# Altium schematic sheet SH4 - 3.3V LINEAR REGULATOR.SchDoc: 3.3V Linear Regulator
size B; CheckedBy: Cindy Li; Engineer: Farris Matar; Organization: UW Robotics; Address1: 200 University Avenue; Address2: Waterloo; Address3: Ontario; Address4: Canada N2L 3G6; DocumentNumber: 4; Revision: 3; SheetNumber: 4; SheetTotal: 9
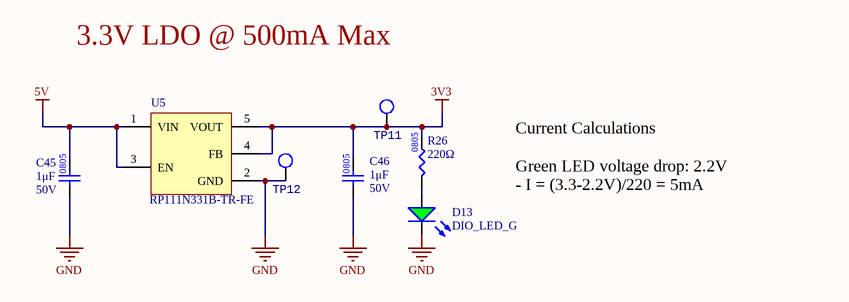
[diagram p0: SH4 - 3.3V LINEAR REGULATOR.SchDoc]

## Parts
C45  value 1μF  Voltage Rating: 50V  [CAP2012]  (hidden comment: CAP_1uF_50V_0805)
C46  value 1μF  Voltage Rating: 50V  [CAP2012]  (hidden comment: CAP_1uF_50V_0805)
D13  DIO_LED_G  [LED_0805_GREEN]
R26  value 220Ω  [RES0805]  (hidden comment: RES_220Ω_0805_5%)
TP11  TESTPOINT_LOOP  [TESTPOINT_LOOP]  (value not drawn)
TP12  TESTPOINT_LOOP  [TESTPOINT_LOOP]  (value not drawn)
U5  Manufacturer Part Number 1: RP111N331B-TR-FE  [SOT23-5]  (hidden comment: LDO_3.3V_500mA)

## Nets
3V3: C46.2 R26.2 TP11.1 U5.4(FB) U5.5(VOUT)
5V: C45.2 U5.1(VIN) U5.3(EN)
GND: C45.1 C46.1 D13.2(K) TP12.1 U5.2(GND)
NetD13_1: D13.1(A) R26.1

## Notes on the sheet
- 3.3V LDO @ 500mA Max
- Current Calculations
  Green LED voltage drop: 2.2V
  - I = (3.3-2.2V)/220 = 5mA
- Title:
- Project:
- Date:
- Rev:
- Reviewer:
- Engineer:
- Sheet:
- of

## Library data of the parts
C45 C46 = CAP_1uF_50V_0805: CAP CER 1UF 50V X7R 0805; Manufacturer 1: Samsung Electro-Mechanics; Manufacturer Part Number 1: CL21B105KBFNNNG; Supplier Part Number 1: 1276-6470-1-ND; Supplier 1: Digi-Key; LCSC Part #: C28323; Mounting Type: SMD; Package: 0805
D13 = DIO_LED_G: LED GREEN DIFFUSED 0805 SMD; Manufacturer Part Number 1: LG R971-KN-1; Manufacturer 1: OSRAM; Forward Voltage Drop: 2.2V; Package/Footprint: 0805; Supplier Part Number 1: 475-1410-1-ND; Supplier 1: Digi-Key; Mounting Type: SMD
R26 = RES_220Ω_0805_5%: RES 220 OHM 5% 1/2W 0805; Manufacturer 1: Panasonic Electronic Components; Manufacturer Part Number 1: ERJ-P06J221V; Supplier Part Number 1: P220ADCT-ND; Supplier 1: Digi-Key; LCSC Part #: C17557; Mounting Type: SMD; Package: 0805
TP11 TP12 = TESTPOINT_LOOP: TESTPOINT THRUHOLE; Manufacturer 1: Keystone Electronics; Manufacturer Part Number 1: 5002; Package/Footprint: TH; Supplier 1: Digi-Key; Supplier Part Number 1: 36-5002-ND; Mounting Type: TH
U5 = LDO_3.3V_500mA: IC REG LINEAR 3.3V 500MA SOT23-5; Manufacturer 1: RICOH Electronic Devices Co., LTD.; Input Voltage (Max): 5.25V; Voltage Dropout (Max): 0.32V; Package/Footprint: SOT-25; Supplier 1: Digi-Key; Supplier Part Number 1: 2129-RP111N331B-TR-FECT-ND; Output Voltage (Fixed): 3.3V; Output Current: 500mA; Operating Temperature: -40°C - 85°C; Mounting Type: SMD